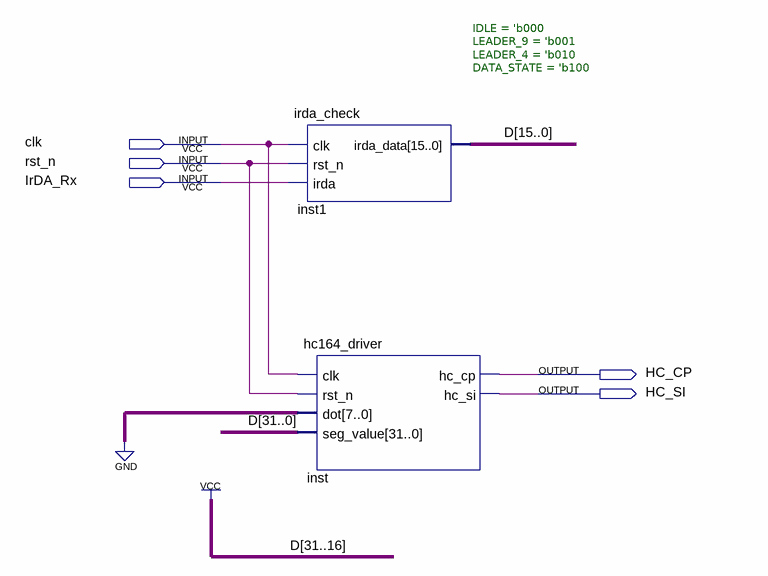
[diagram p0: schematic sheet]
// Quartus schematic IrDX_Receive.bdf as structural Verilog: 2 symbols, 5 pins
module IrDX_Receive (
  input  clk,
  input  rst_n,
  input  IrDA_Rx,
  output HC_CP,
  output HC_SI
);

  wire [15:0] D;

  irda_check #(.IDLE('b000), .LEADER_9('b001), .LEADER_4('b010), .DATA_STATE('b100)) inst1 (
    .clk(clk), .rst_n(rst_n), .irda(IrDA_Rx), .irda_data(D));
  hc164_driver inst (
    .clk(clk), .rst_n(rst_n), .dot({8{1'b0}}), .seg_value({{16{1'b1}}, D}), .hc_cp(HC_CP), .hc_si(HC_SI));
endmodule
